# EAGLE design usmernowacz (EAGLE 9.6.2)
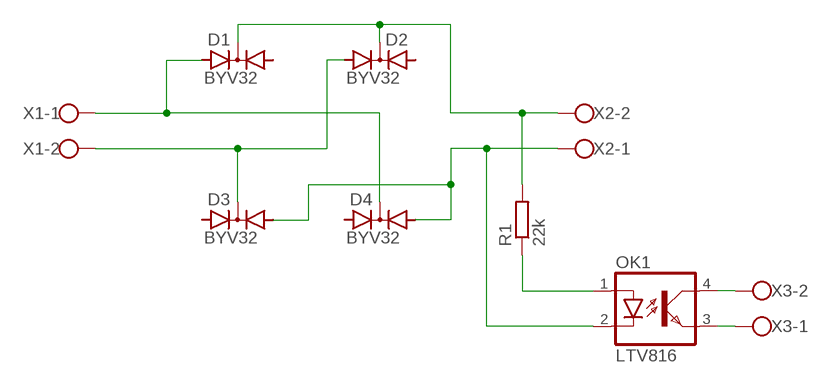
[diagram p0: schematic, sheet 1]

## Parts
D1  BYV32  [TO220ABS]
D2  BYV32  [TO220ABS]
D3  BYV32  [TO220ABS]
D4  BYV32  [TO220ABS]
OK1  LTV816  [DIL04]
R1  22k  R-EU_R1206  [R1206]
X1  W237-102  [W237-102]
X2  W237-102  [W237-102]
X3  W237-102  [W237-102]

## Nets
N$1: D1.A1 D4.C X1.1
N$2: D1.C D2.C R1.2 X2.2
N$3: D2.A1 D3.C X1.2
N$4: D3.A2 D4.A2 OK1.2(C) X2.1
N$5: OK1.1(A) R1.1
N$6: OK1.3(EMIT) X3.1
N$7: OK1.4(COL) X3.2
Unconnected: D1.A2 D2.A2 D3.A1 D4.A1

## Library data of the parts
D1-D4 = diode:BYV32: DIODE 2 x Si diode 200 V, 20 A/230 Apeak, 25 ns
OK1 = optocoupler:LTV816: OPTO COUPLER Source: LITEON, LTV816.pdf; OC_FARNELL: unknown; OC_NEWARK: unknown
R1 = rcl:R-EU_: RESISTOR, European symbol; SPICEPREFIX: R
X1-X3 = con-wago-500:W237-102: WAGO SCREW CLAMP; MPN: 237-102; OC_FARNELL: unknown; OC_NEWARK: 70K9898

## Board
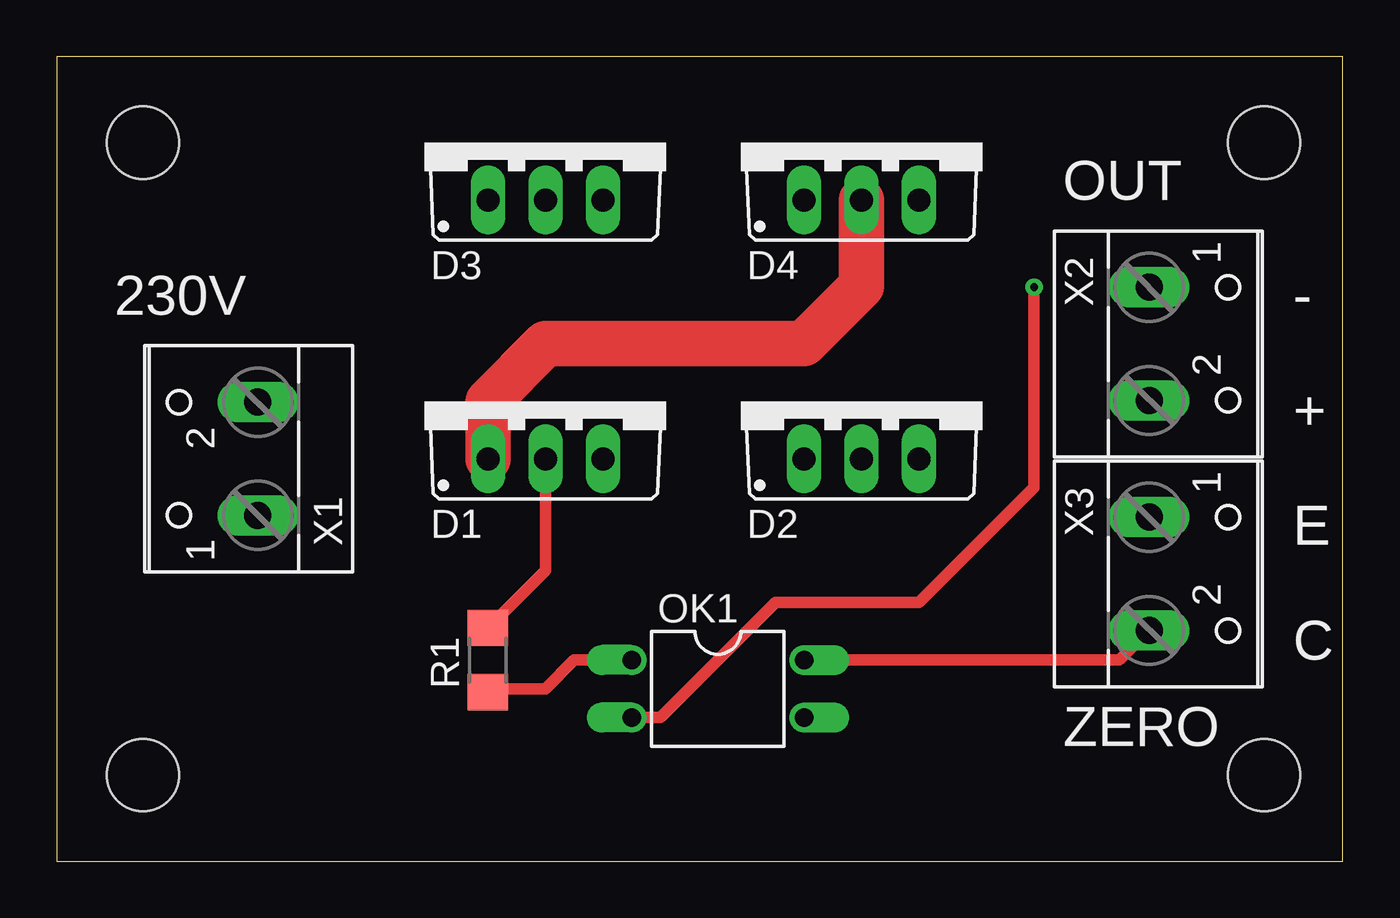
[diagram p1: board, top side]
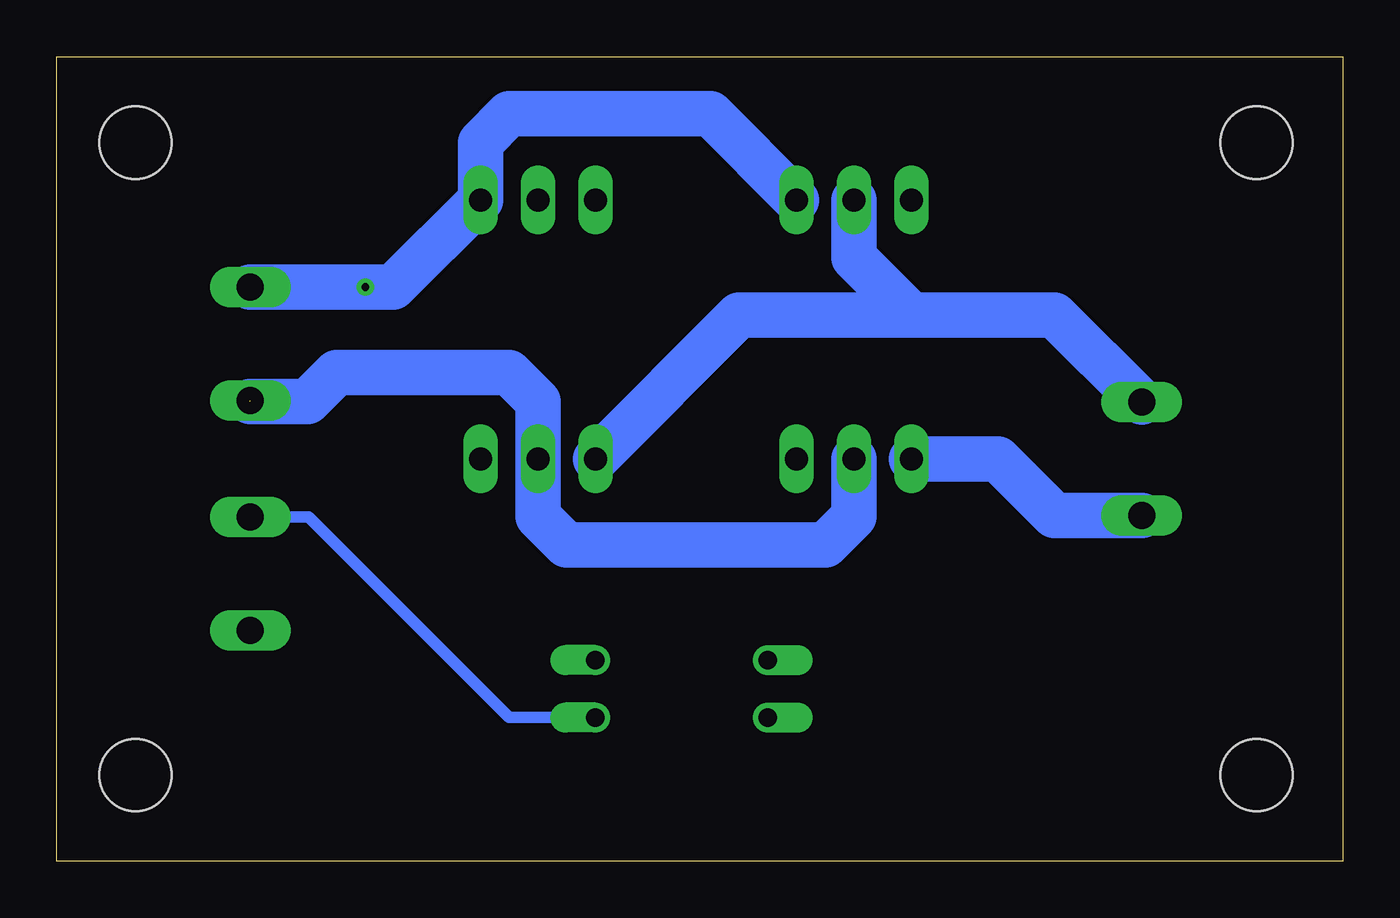
[diagram p2: board, bottom side, seen from below]

Size 56.82 x 35.55 mm. Coordinates in mm from the lower left corner, seen from the top.
Outline: 0,0 56.82,0 56.82,35.55 0,35.55 0,0
Copper layers (1*16): Top 0.035mm / dielectric 1.5mm / Bottom 0.035mm
Design rules "default": minimum track width 6mil, minimum drill 0.35mm, track to track 6mil, track to pad 6mil, pad to pad 6mil, via to via 6mil, smd to smd 6mil, copper to edge 40mil, drill to drill 6mil, minimum pad ring 10mil, minimum via ring 8mil, stop-mask expansion 4mil, vias tented up to drill 0mil, thermal gap 10mil
Holes 3.2 mm at 3.81,3.81 53.34,3.81 53.34,31.75 3.81,31.75

### Footprints (pad centres in the part's own frame; a part is rotated, then mirrored left to right if it is on the bottom)
TO220ABS = drill 1.016 long: A1 -2.54,-2.54; A2 2.54,-2.54; C 0,-2.54
DIL04 = drill 0.813 offset: 1 -1.27,-3.81; 2 1.27,-3.81; 3 1.27,3.81; 4 -1.27,3.81
R1206 = smd 1.6 x 1.803: 1 -1.422,0; 2 1.422,0
W237-102 = drill 1.194 long: 1 -2.5,-1.27; 2 2.5,-1.27

### Placement (x,y rotation side)
D1  21.59,20.32 0 top
D2  35.56,20.32 0 top
D3  21.59,31.75 0 top
D4  35.56,31.75 0 top
OK1  29.21,7.62 270 top
R1  19.05,8.89 90 top
X1  7.62,17.78 90 top
X2  49.53,22.86 270 top
X3  49.53,12.7 270 top

### Tracks (layer width: path | path; a pad name or v marks a point on that pad's centre or on a via)
N$1
  Top 2: D1.A1 19.05,20.32 21.59,22.86 33.02,22.86 35.56,25.4 D4.C
  Bottom 2: X1.1 12.74,15.28 15.24,17.78 D1.A1
N$2  (1 unrouted)
  Top 0.5: R1.2 21.59,12.85 D1.C
  Bottom 2: D1.C 21.59,15.24 22.86,13.97 34.29,13.97 35.56,15.24 D2.C 35.56,20.32 36.83,21.59 44.45,21.59 45.72,20.32 48.26,20.32
N$3
  Bottom 2: X1.2 12.74,24.13 19.05,24.13 | 19.05,24.13 21.59,26.67 D3.C | D2.A1 26.67,24.13 19.05,24.13
N$4  (via drill 0.35)
  Top 0.5: OK1.2 26.67,6.35 31.75,11.43 38.1,11.43 43.18,16.51 v43.18,25.36
  Bottom 2: D3.A2 27.94,33.02 36.83,33.02 38.1,31.75 D4.A2 41.95,25.36 v43.18,25.36 X2.1
N$5
  Top 0.5: R1.1 19.2,7.62 21.59,7.62 22.86,8.89 OK1.1
N$6
  Bottom 0.5: OK1.3 36.83,6.35 45.68,15.2 X3.1
N$7
  Top 0.5: 33.17,9.04 OK1.4 46.95,8.89 X3.2

### Text on the board
tNames: OUT | 230V | - | + | E | C | ZERO